# EAGLE design IR analog (EAGLE 8.7.0)
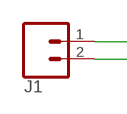
[diagram p0: schematic, sheet 1, part 1 of 2]
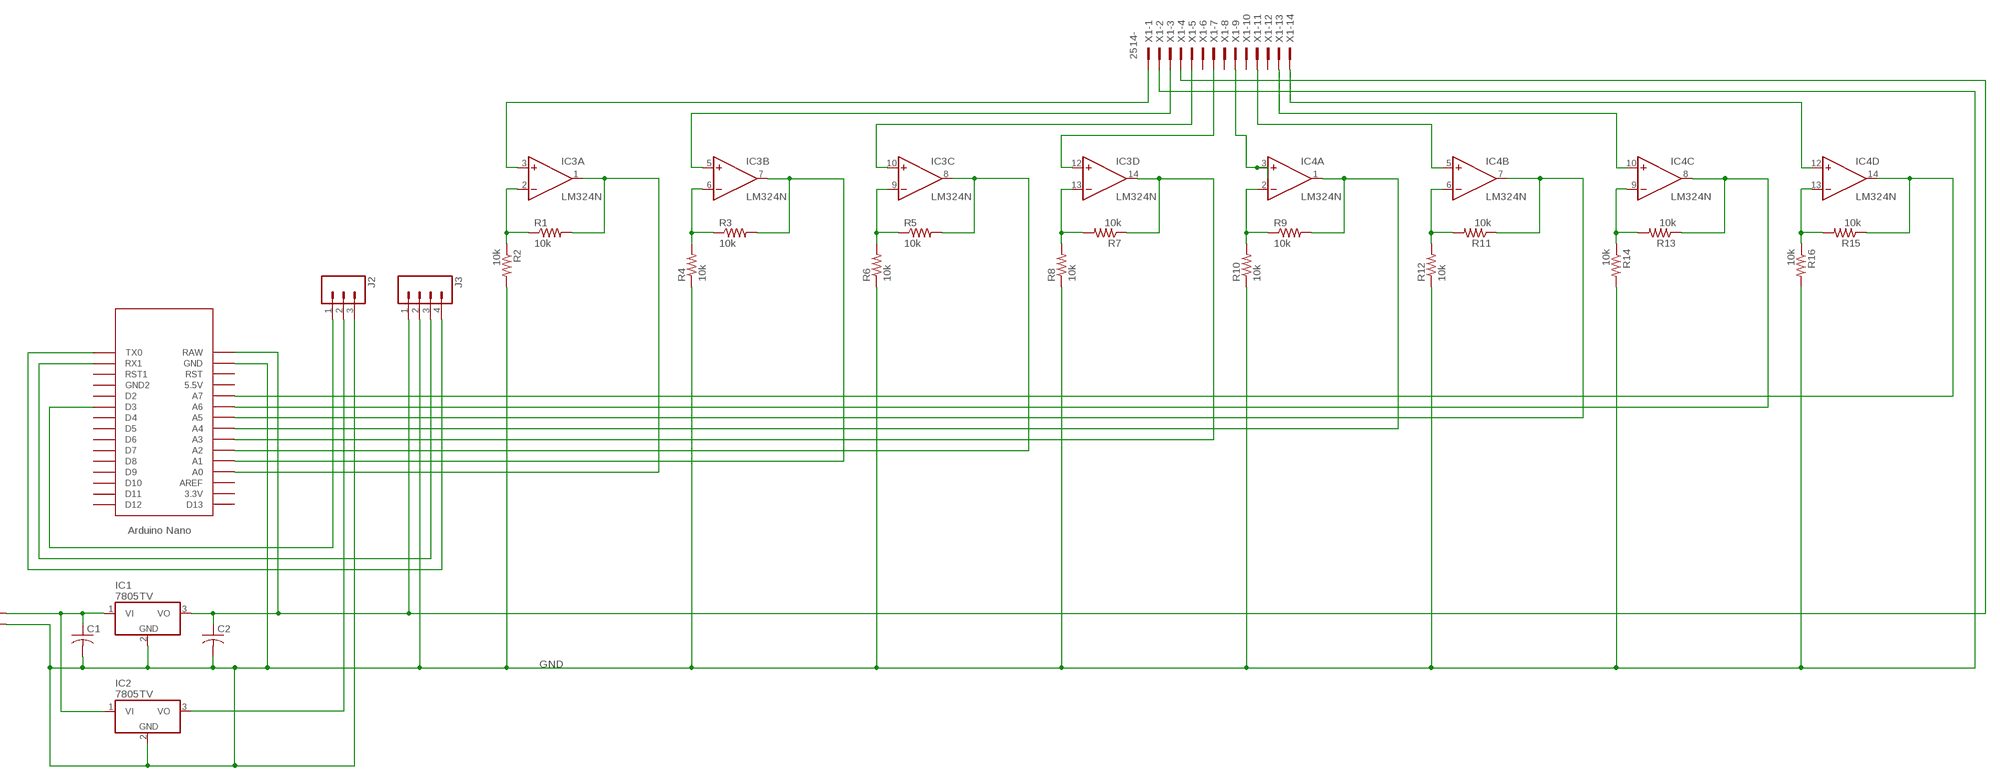
[diagram p1: schematic, sheet 1, part 2 of 2]

## Parts
C1  C-US025-060X050  [C025-060X050]
C2  C-US025-060X050  [C025-060X050]
IC1  7805TV  [TO220V]
IC2  7805TV  [TO220V]
IC3  LM324N  [DIL14]
IC4  LM324N  [DIL14]
J1  CONN_023.5MM_LOCK  [SCREWTERMINAL-3.5MM-2_LOCK]
J2  CONN_03LONGPADS  [1X03_LONGPADS]
J3  CONN_04LONGPADS  [1X04_LONGPADS]
R1  10k  R-US_0204/5  [0204/5]
R2  10k  R-US_0204/5  [0204/5]
R3  10k  R-US_0204/5  [0204/5]
R4  10k  R-US_0204/5  [0204/5]
R5  10k  R-US_0204/5  [0204/5]
R6  10k  R-US_0204/5  [0204/5]
R7  10k  R-US_0204/5  [0204/5]
R8  10k  R-US_0204/5  [0204/5]
R9  10k  R-US_0204/5  [0204/5]
R10  10k  R-US_0204/5  [0204/5]
R11  10k  R-US_0204/5  [0204/5]
R12  10k  R-US_0204/5  [0204/5]
R13  10k  R-US_0204/5  [0204/5]
R14  10k  R-US_0204/5  [0204/5]
R15  10k  R-US_0204/5  [0204/5]
R16  10k  R-US_0204/5  [0204/5]
U$1  NANO  [NANO]
X1  2514-  [PAK100/2500-14]

## Nets
GND: C1.2 C2.2 IC1.2(GND) IC2.2(GND) J1.2 J2.3 J3.2 R2.2 R4.1 R6.1 R8.1 R10.1 R12.1 R14.2 R16.2 U$1.GND X1.2
N$1: C1.1 IC1.1(VI) IC2.1(VI) J1.1
N$2: C2.1 IC1.3(VO) J3.1 U$1.RAW X1.4
N$3: IC4.9(C:-IN) R13.2 R14.1
N$4: IC3.2(A:-IN) R1.1 R2.1
N$8: IC3.1(A:OUT) R1.2 U$1.A0
N$9: IC3.7(B:OUT) R3.2 U$1.A1
N$12: IC3.6(B:-IN) R3.1 R4.2
N$13: IC3.8(C:OUT) R5.2 U$1.A2
N$16: IC3.9(C:-IN) R5.1 R6.2
N$17: IC3.13(D:-IN) R7.2 R8.2
N$19: IC3.14(D:OUT) R7.1 U$1.A3
N$20: IC4.1(A:OUT) R9.2 U$1.A4
N$21: IC4.2(A:-IN) R9.1 R10.2
N$24: IC4.6(B:-IN) R11.2 R12.2
N$27: IC4.7(B:OUT) R11.1 U$1.A5
N$29: IC4.8(C:OUT) R13.1 U$1.A6
N$32: IC4.14(D:OUT) R15.1 U$1.A7
N$33: IC4.13(D:-IN) R15.2 R16.1
N$36: IC3.3(A:+IN) X1.1
N$37: IC3.5(B:+IN) X1.3
N$38: IC3.10(C:+IN) X1.5
N$39: IC3.12(D:+IN) X1.7
N$40: IC4.3(A:+IN) X1.9
N$41: IC4.10(C:+IN) X1.13
N$42: IC4.5(B:+IN) X1.11
N$43: IC4.12(D:+IN) X1.14
N$44: J2.1 U$1.D3
N$45: IC2.3(VO) J2.2
N$46: J3.3 U$1.RX1
N$47: J3.4 U$1.TX0
Unconnected: U$1.3.3V U$1.5V(5.5V) U$1.AREF U$1.D2 U$1.D4 U$1.D5 U$1.D6 U$1.D7 U$1.D8 U$1.D9 U$1.D10 U$1.D11 U$1.D12 U$1.D13 U$1.GND1(GND2) U$1.ICSP1 U$1.ICSP2 U$1.ICSP3 U$1.ICSP4 U$1.ICSP5 U$1.ICSP6 U$1.RST U$1.RST1 X1.6 X1.8 X1.10 X1.12

## Power pins joined to a net without a drawn wire
GND: IC3.11(P:V-) IC4.11(P:V-)
V+: IC3.4(P:V+) IC4.4(P:V+)

## Library data of the parts
C1 C2 = rcl:C-US: CAPACITOR, American symbol; SPICEPREFIX: C
IC1 IC2 = linear:78*: Positive VOLTAGE REGULATOR Source: http://cache.national.com/ds/LM/LM78L05.pdf http://www.fairchildsemi.com/ds/LM/LM7805.pdf
IC3 IC4 = linear:LM324: OP AMP
J1 = SparkFun-Connectors:CONN_02: Multi connection point. Often used as Generic Header-pin footprint for 0.1 inch spaced/style header connections On any of the 0.1 inch spaced packages, you can populate with these: Break Away Headers - Straight <https://www.sparkfun.com/products/116> (PRT-00116) Break Away Male Headers - Right Angle <https://www.sparkfun.com/products/553> (PRT-00553) Female Headers <https://www.sparkfun.com/products/115> (PRT-00115) Break Away Headers - Machine Pin <https://www.sparkfun.com/products/117> (PRT-00117) Break Away Female Headers - Swiss Machine Pin <https://www.sparkfun.com/products/743> (PRT-00743) For SCREWTERMINALS and SPRING TERMINALS visit here: Screw Terimnals on SparkFun.com <https://www.sparkfun.com/search/results?term=Screw+Terminals> (5mm/3.5mm/2.54mm spacing) This device is also useful as a general connection point to wire up your design to another part of your project. Our various solder wires solder well into these plated through hole pads. Hook-Up Wire - Assortment (Stranded, 22 AWG) <https://www.sparkfun.com/products/11375> (PRT-11375) Hook-Up Wire - Assortment (Solid Core, 22 AWG) <https://www.sparkfun.com/products/11367> (PRT-11367) View the entire wire category on our website here <https://www.sparkfun.com/categories/141> Special notes: Molex polarized connector foot print use with: PRT-08233 with associated crimp pins and housings. 2.54_SCREWTERM for use with PRT-10571. 3.5mm Screw Terminal footprints for PRT-08084 5mm Screw Terminal footprints for use with PRT-08432; PROD_ID: CONN-08399
J2 = SparkFun-Connectors:CONN_03: Multi connection point. Often used as Generic Header-pin footprint for 0.1 inch spaced/style header connections On any of the 0.1 inch spaced packages, you can populate with these: Break Away Headers - Straight <https://www.sparkfun.com/products/116> (PRT-00116) Break Away Male Headers - Right Angle <https://www.sparkfun.com/products/553> (PRT-00553) Female Headers <https://www.sparkfun.com/products/115> (PRT-00115) Break Away Headers - Machine Pin <https://www.sparkfun.com/products/117> (PRT-00117) Break Away Female Headers - Swiss Machine Pin <https://www.sparkfun.com/products/743> (PRT-00743) Stackable Header - 3 Pin (Female, 0.1") <https://www.sparkfun.com/products/13875> (PRT-13875) For SCREWTERMINALS and SPRING TERMINALS visit here: Screw Terimnals on SparkFun.com <https://www.sparkfun.com/search/results?term=Screw+Terminals> (5mm/3.5mm/2.54mm spacing) This device is also useful as a general connection point to wire up your design to another part of your project. Our various solder wires solder well into these plated through hole pads. Hook-Up Wire - Assortment (Stranded, 22 AWG) <https://www.sparkfun.com/products/11375> (PRT-11375) Hook-Up Wire - Assortment (Solid Core, 22 AWG) <https://www.sparkfun.com/products/11367> (PRT-11367) View the entire wire category on our website here <https://www.sparkfun.com/categories/141> Special notes: Molex polarized connector foot print use with SKU : PRT-08232 with associated crimp pins and housings.
J3 = SparkFun-Connectors:CONN_04: Multi connection point. Often used as Generic Header-pin footprint for 0.1 inch spaced/style header connections On any of the 0.1 inch spaced packages, you can populate with these: Break Away Headers - Straight <https://www.sparkfun.com/products/116> (PRT-00116) Break Away Male Headers - Right Angle <https://www.sparkfun.com/products/553> (PRT-00553) Female Headers <https://www.sparkfun.com/products/115> (PRT-00115) Break Away Headers - Machine Pin <https://www.sparkfun.com/products/117> (PRT-00117) Break Away Female Headers - Swiss Machine Pin <https://www.sparkfun.com/products/743> (PRT-00743) For SCREWTERMINALS and SPRING TERMINALS visit here: Screw Terimnals on SparkFun.com <https://www.sparkfun.com/search/results?term=Screw+Terminals> (5mm/3.5mm/2.54mm spacing) This device is also useful as a general connection point to wire up your design to another part of your project. Our various solder wires solder well into these plated through hole pads. Hook-Up Wire - Assortment (Stranded, 22 AWG) <https://www.sparkfun.com/products/11375> (PRT-11375) Hook-Up Wire - Assortment (Solid Core, 22 AWG) <https://www.sparkfun.com/products/11367> (PRT-11367) View the entire wire category on our website here <https://www.sparkfun.com/categories/141> Special notes: Molex polarized connector foot print use with SKU : PRT-08231 with associated crimp pins and housings. 1MM SMD Version SKU: PRT-10208; PROD_ID: CONN-09696
R1-R16 = rcl:R-US_: RESISTOR, American symbol; SPICEPREFIX: R
U$1 = Arduino-clone:NANO: Arduino Nano
X1 = con-3m:2514-: 3M (TM) Pak 100 4-Wall Header Source: 3M; OC_FARNELL: unknown; OC_NEWARK: unknown

## Board
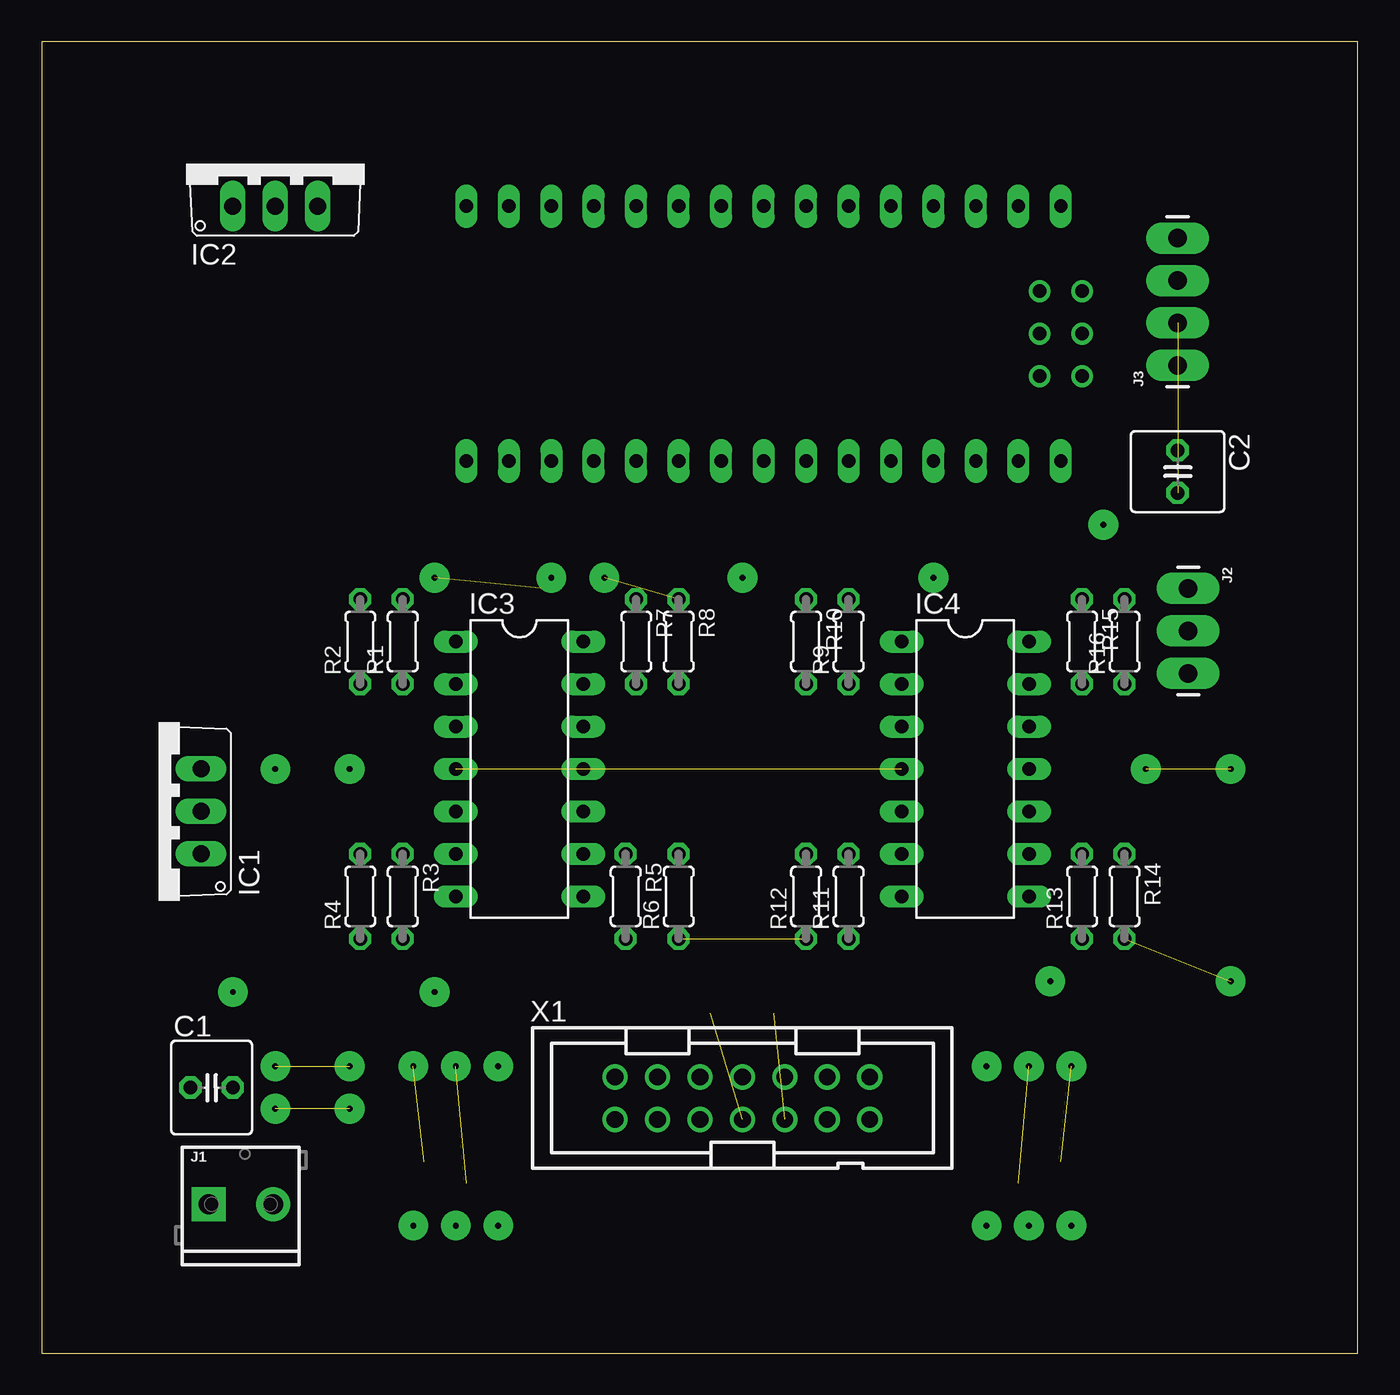
[diagram p2: board, top side]
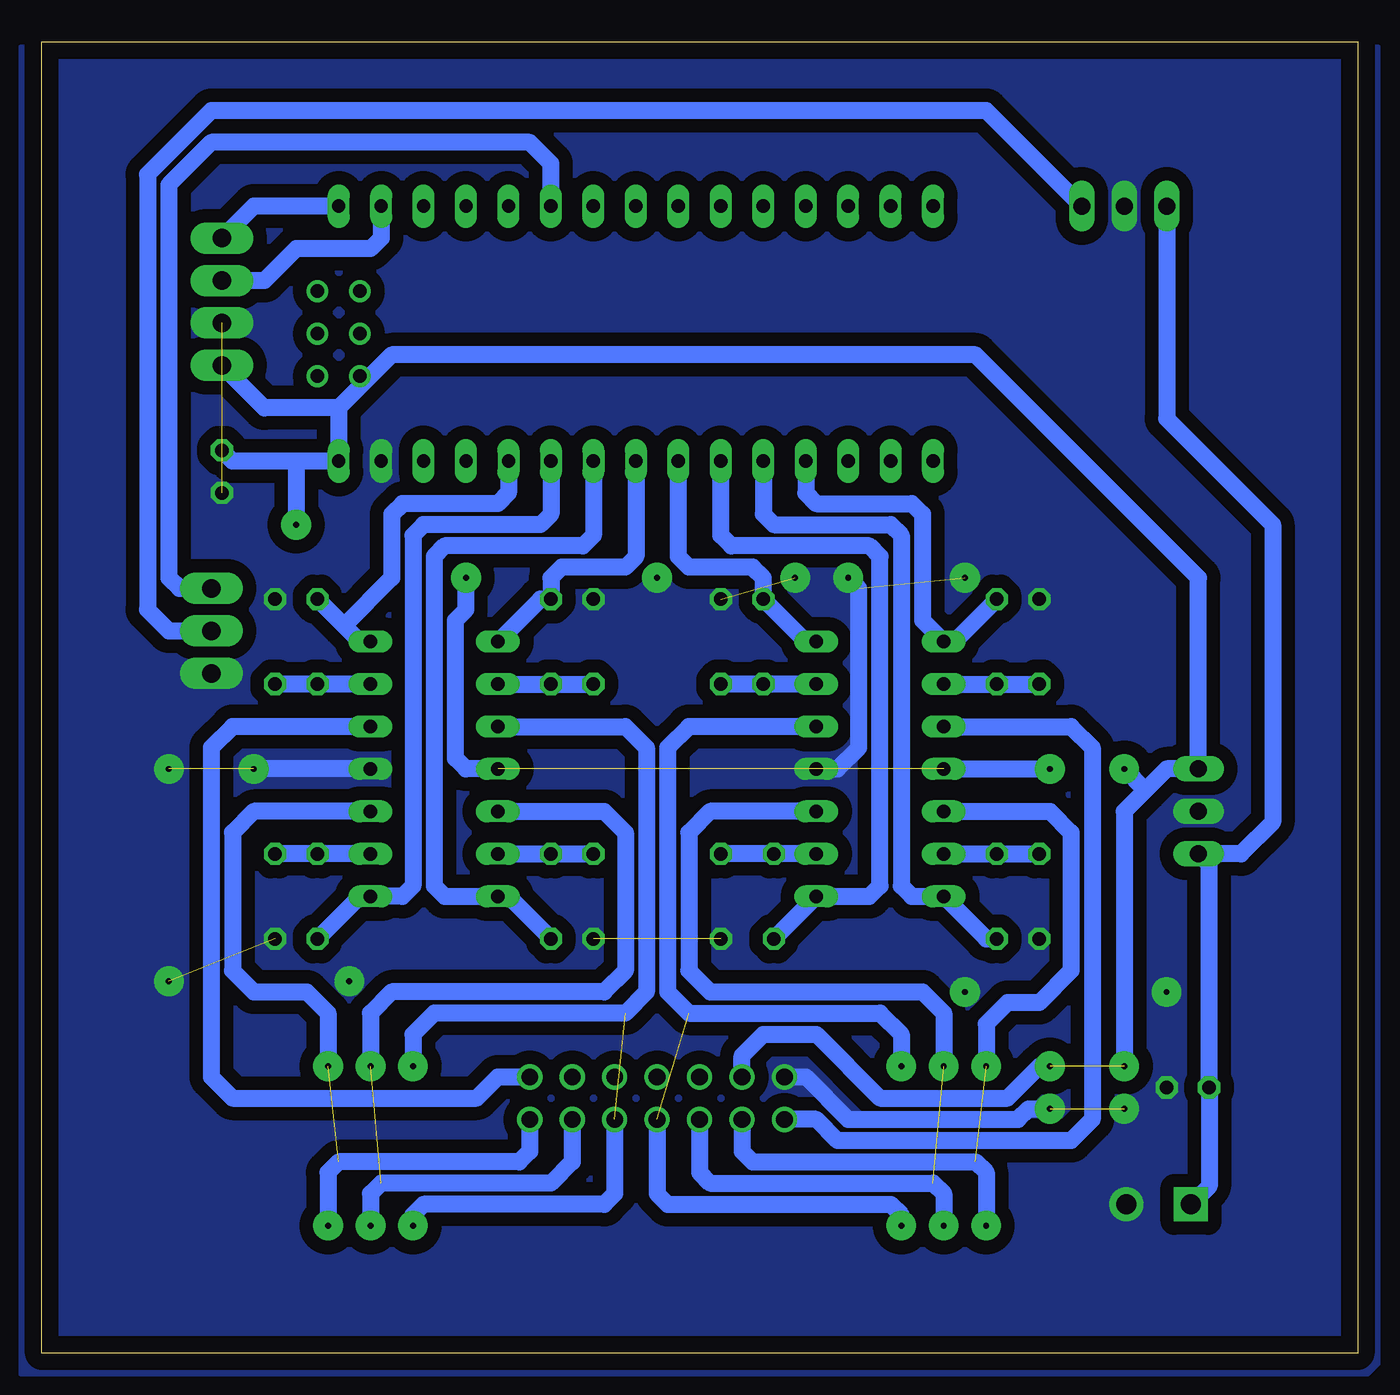
[diagram p3: board, bottom side, seen from below]

Size 78.72 x 78.41 mm. Coordinates in mm from the lower left corner, seen from the top.
Outline: 0,0 78.72,0 78.72,78.41 0,78.41 0,0
Copper layers (1*16): Top 0.035mm / dielectric 1.5mm / Bottom 0.035mm
Design rules "default": minimum track width 6mil, minimum drill 0.35mm, track to track 6mil, track to pad 6mil, pad to pad 6mil, via to via 6mil, smd to smd 6mil, copper to edge 40mil, drill to drill 6mil, minimum pad ring 10mil, minimum via ring 8mil, stop-mask expansion 4mil, vias tented up to drill 0mil, thermal gap 10mil

### Footprints (pad centres in the part's own frame; a part is rotated, then mirrored left to right if it is on the bottom)
C025-060X050 = drill 0.813 octagon: 1 -1.27,0; 2 1.27,0
TO220V = drill 1.016 long: 1 -2.54,-2.54; 2 0,-2.54; 3 2.54,-2.54
DIL14 = drill 0.813 long: 1 -7.62,-3.81; 2 -5.08,-3.81; 3 -2.54,-3.81; 4 0,-3.81; 5 2.54,-3.81; 6 5.08,-3.81; 7 7.62,-3.81; 8 7.62,3.81; 9 5.08,3.81; 10 2.54,3.81; 11 0,3.81; 12 -2.54,3.81; 13 -5.08,3.81; 14 -7.62,3.81
SCREWTERMINAL-3.5MM-2_LOCK = drill 1.2 pad 2.032 square: 1 -0.178,0 | drill 1.2 pad 2.032: 2 3.678,0
1X03_LONGPADS = drill 1.118 pad 1.88 long: 1 0,0; 2 2.54,0; 3 5.08,0
1X04_LONGPADS = drill 1.118 pad 1.88 long: 1 0,0; 2 2.54,0; 3 5.08,0; 4 7.62,0
0204/5 = drill 0.813 octagon: 1 -2.54,0; 2 2.54,0
NANO = drill 0.8 long: 3.3V -10.16,24.13; 5V -10.16,-1.27; A0 -10.16,19.05; A1 -10.16,16.51; A2 -10.16,13.97; A3 -10.16,11.43; A4 -10.16,8.89; A5 -10.16,6.35; A6 -10.16,3.81; A7 -10.16,1.27; AREF -10.16,21.59; D2 5.08,1.27; D3 5.08,3.81; D4 5.08,6.35; D5 5.08,8.89; D6 5.08,11.43; D7 5.08,13.97; D8 5.08,16.51; D9 5.08,19.05; D10 5.08,21.59; D11 5.08,24.13; D12 5.08,26.67; D13 -10.16,26.67; GND -10.16,-6.35; GND1 5.08,-1.27; RAW -10.16,-8.89; RST -10.16,-3.81; RST1 5.08,-3.81; RX1 5.08,-6.35; TX0 5.08,-8.89 | drill 0.8: ICSP1 -5.08,-10.16; ICSP2 -5.08,-7.62; ICSP3 -2.54,-10.16; ICSP4 -2.54,-7.62; ICSP5 0,-10.16; ICSP6 0,-7.62
PAK100/2500-14 = drill 1 pad 1.422: 1 -7.62,-1.27; 2 -7.62,1.27; 3 -5.08,-1.27; 4 -5.08,1.27; 5 -2.54,-1.27; 6 -2.54,1.27; 7 0,-1.27; 8 0,1.27; 9 2.54,-1.27; 10 2.54,1.27; 11 5.08,-1.27; 12 5.08,1.27; 13 7.62,-1.27; 14 7.62,1.27

### Placement (x,y rotation side)
C1  10.16,15.88 0 top
C2  67.94,52.7 270 top
IC1  6.98,32.38 90 top
IC2  13.97,71.12 0 top
IC3  28.58,34.92 270 top
IC4  55.24,34.92 270 top
J1  10.16,8.89 0 top
J2  68.58,45.72 270 top
J3  67.94,59.05 90 top
R1  [0204/5]  21.59,42.55 90 top
R2  [0204/5]  19.05,42.55 90 top
R3  [0204/5]  21.59,27.3 270 top
R4  [0204/5]  19.05,27.3 90 top
R5  [0204/5]  34.92,27.3 270 top
R6  [0204/5]  38.1,27.3 90 top
R7  [0204/5]  35.56,42.55 270 top
R8  [0204/5]  38.1,42.55 270 top
R9  [0204/5]  48.26,42.55 90 top
R10  [0204/5]  45.72,42.55 270 top
R11  [0204/5]  48.26,27.3 90 top
R12  [0204/5]  45.72,27.3 90 top
R13  [0204/5]  62.23,27.3 90 top
R14  [0204/5]  64.77,27.3 270 top
R15  [0204/5]  62.23,42.55 270 top
R16  [0204/5]  64.77,42.55 90 top
U$1  52.07,63.5 90 top
X1  41.91,15.24 0 top

### Tracks (layer width: path | path; a pad name or v marks a point on that pad's centre or on a via)
GND  (via drill 0.35 pad 1.78)  (7 unrouted)
  Bottom 1.016: X1.2 33.02,16.51 30.48,13.97 20.32,13.97 19.69,14.61 v18.41,14.61 | IC4.11 v66.04,34.92 | IC3.11 31.11,34.92 29.84,36.2 29.84,45.72 v30.48,46.35
  other vias: 13.97,14.61 71.12,34.92 23.49,46.35 11.43,21.59 23.49,21.59 60.33,22.23 71.12,22.23 33.66,46.35 41.91,46.35
  pour Bottom (isolate 0.813, no thermals): -1.27,78.11 80.01,78.11 80.01,-1.27 -0.64,-1.27 -1.27,-0.64
N$1
  Bottom 1.016: IC2.1 11.43,55.88 5.08,49.53 5.08,31.75 6.98,29.84 IC1.1 8.89,29.21 C1.1 8.89,9.98 J1.1
N$2  (via drill 0.35 pad 1.78)  (1 unrouted)
  Bottom 1.016: X1.4 36.83,17.78 35.56,19.05 32.38,19.05 28.58,15.24 20.95,15.24 19.05,17.14 v18.41,17.14 | 60.96,56.52 57.78,59.69 22.86,59.69 9.52,46.35 IC1.3 11.43,34.92 12.7,33.66 | 60.96,56.52 U$1.RAW 63.5,53.34 | 60.96,56.52 65.41,56.52 J3.1 | 63.5,53.34 67.31,53.34 C2.1 | 63.5,53.34 v63.5,49.53 | 12.7,33.66 13.97,32.38 13.97,17.14 | 12.7,33.66 v13.97,34.92
N$3
  Bottom 1.016: IC4.9 R13.2 R14.1
N$4
  Bottom 1.016: IC3.2 R1.1 R2.1
N$6  (via drill 0.35 pad 1.78)
  other vias: 13.97,17.14
N$8
  Bottom 1.016: U$1.A0 33.02,51.44 32.38,50.8 26.67,50.8 26.03,50.16 26.03,43.81 IC3.1 24.13,42.55 R1.2
N$9
  Bottom 1.016: R3.2 22.22,24.77 IC3.7 26.67,27.3 27.3,27.94 27.3,48.9 27.94,49.53 34.92,49.53 35.56,50.16 U$1.A1
N$12
  Bottom 1.016: IC3.6 R3.1 R4.2
N$13
  Bottom 1.016: R5.2 IC3.8 29.21,27.3 28.58,27.94 28.58,47.62 29.21,48.26 37.47,48.26 38.1,48.9 U$1.A2
N$16
  Bottom 1.016: IC3.9 R5.1 R6.2
N$17
  Bottom 1.016: IC3.13 R7.2 R8.2
N$19
  Bottom 1.016: IC3.14 33.02,42.55 R7.1 35.56,46.35 36.19,46.99 40,46.99 40.64,47.62 U$1.A3
N$20
  Bottom 1.016: IC4.1 48.89,45.09 R9.2 48.26,46.35 47.62,46.99 43.81,46.99 43.18,47.62 U$1.A4
N$21
  Bottom 1.016: IC4.2 R9.1 R10.2
N$24
  Bottom 1.016: IC4.6 R11.2 R12.2
N$27
  Bottom 1.016: R11.1 50.8,27.3 IC4.7 54.61,27.3 55.24,27.94 55.24,47.62 54.61,48.26 46.36,48.26 45.72,48.9 U$1.A5
N$29
  Bottom 1.016: R13.1 59.69,27.3 IC4.8 57.15,27.3 56.52,27.94 56.52,48.9 55.88,49.53 48.89,49.53 48.26,50.16 U$1.A6
N$32
  Bottom 1.016: IC4.14 59.69,42.55 60.64,43.5 | 60.64,43.5 R15.1 | 60.64,43.5 57.78,46.35 57.78,50.16 57.15,50.8 51.44,50.8 50.8,51.44 U$1.A7
N$33
  Bottom 1.016: IC4.13 R15.2 R16.1
N$36
  Bottom 1.016: IC3.3 17.14,37.47 15.88,36.2 15.88,13.97 17.14,12.7 31.11,12.7 32.38,13.97 X1.1
N$37  (via drill 0.35 pad 1.78)  (1 unrouted)
  Bottom 1.016: IC3.5 18.41,32.38 17.14,31.11 17.14,22.86 19.05,20.95 20.95,20.95 22.22,19.68 v22.22,17.14 | X1.3 36.83,12.06 36.19,11.43 22.86,11.43 22.22,10.79 v22.22,7.62
N$38  (via drill 0.35 pad 1.78)  (1 unrouted)
  Bottom 1.016: IC3.10 38.73,32.38 40,31.11 40,22.86 38.73,21.59 26.03,21.59 24.77,20.32 v24.77,17.14 | v24.77,7.62 24.77,9.53 25.4,10.16 38.73,10.16 39.37,10.79 X1.5
N$39  (via drill 0.35 pad 1.78)  (1 unrouted)
  Bottom 1.016: IC3.12 40,37.47 41.27,36.2 41.27,21.59 40,20.32 28.58,20.32 27.3,19.05 v27.3,17.14 | X1.7 41.91,9.53 41.27,8.89 27.94,8.89 27.3,8.26 v27.3,7.62
N$40  (via drill 0.35 pad 1.78)  (1 unrouted)
  Bottom 1.016: IC4.3 43.81,37.47 42.55,36.2 42.55,21.59 43.81,20.32 55.24,20.32 56.52,19.05 v56.52,17.14 | X1.9 44.45,9.53 45.08,8.89 55.88,8.89 56.52,8.26 v56.52,7.62
N$41  (via drill 0.35 pad 1.78)  (1 unrouted)
  Bottom 1.016: IC4.10 66.04,32.38 67.31,31.11 67.31,22.86 66.04,21.59 62.86,21.59 61.59,20.32 v61.59,17.14 | X1.13 49.53,12.06 50.16,11.43 60.96,11.43 61.59,10.79 v61.59,7.62
N$42  (via drill 0.35 pad 1.78)  (1 unrouted)
  Bottom 1.016: IC4.5 45.08,32.38 43.81,31.11 43.81,22.86 45.08,21.59 57.78,21.59 59.05,20.32 v59.05,17.14 | X1.11 46.99,11.43 48.26,10.16 58.42,10.16 59.05,9.53 v59.05,7.62
N$43
  Bottom 1.016: IC4.12 67.31,37.47 68.58,36.2 68.58,16.51 67.31,15.24 52.7,15.24 51.44,16.51 X1.14
N$44
  Bottom 1.016: U$1.D3 48.26,71.12 49.53,72.39 68.58,72.39 71.12,69.85 71.12,46.35 70.48,45.72 J2.1
N$45
  Bottom 1.016: IC2.3 22.22,74.3 68.58,74.3 72.39,70.48 72.39,44.45 71.12,43.18 J2.2
N$46
  Bottom 1.016: U$1.RX1 58.42,66.67 59.05,66.04 63.5,66.04 65.41,64.14 J3.3
N$47
  Bottom 1.016: U$1.TX0 66.04,68.58 J3.4
V+  (via drill 0.35 pad 1.78)  (1 unrouted)
  Bottom 1.016: IC3.4 v18.41,34.92 | IC4.4 53.34,34.92 53.97,35.56 53.97,43.81 53.34,44.45 v53.34,46.35